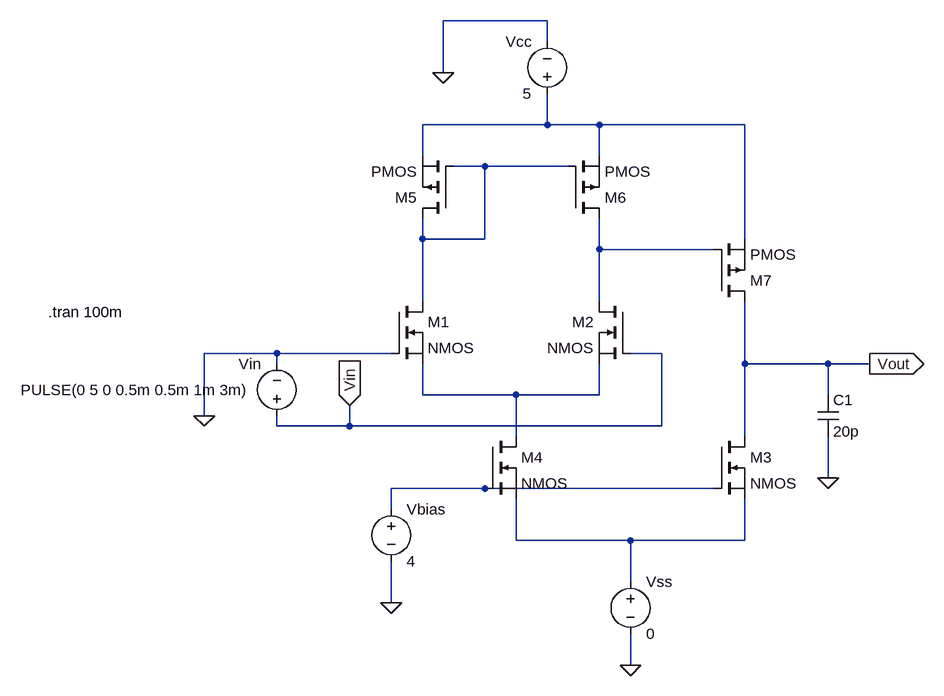
[diagram p0: schematic 2 stage comparator.asc]
2 stage comparator.asc, the LTspice schematic file:
Version 4
SHEET 1 888 680
WIRE 272 -352 112 -352
WIRE 272 -320 272 -352
WIRE 112 -272 112 -352
WIRE 272 -192 272 -240
WIRE 272 -192 80 -192
WIRE 352 -192 272 -192
WIRE 576 -192 352 -192
WIRE 80 -144 80 -192
WIRE 352 -144 352 -192
WIRE 176 -128 128 -128
WIRE 304 -128 176 -128
WIRE 80 -16 80 -48
WIRE 176 -16 176 -128
WIRE 176 -16 80 -16
WIRE 576 -16 576 -192
WIRE 352 0 352 -48
WIRE 528 0 352 0
WIRE 80 80 80 -16
WIRE 352 80 352 0
WIRE -144 160 -256 160
WIRE 32 160 -144 160
WIRE 448 160 400 160
WIRE -144 176 -144 160
WIRE 576 176 576 80
WIRE 704 176 576 176
WIRE 768 176 704 176
WIRE 80 224 80 176
WIRE 224 224 80 224
WIRE 352 224 352 176
WIRE 352 224 224 224
WIRE 704 224 704 176
WIRE -256 256 -256 160
WIRE -144 272 -144 256
WIRE -32 272 -32 240
WIRE -32 272 -144 272
WIRE 448 272 448 160
WIRE 448 272 -32 272
WIRE 224 288 224 224
WIRE 576 288 576 176
WIRE 704 352 704 288
WIRE 176 368 32 368
WIRE 528 368 176 368
WIRE 32 400 32 368
WIRE 224 448 224 384
WIRE 400 448 224 448
WIRE 576 448 576 384
WIRE 576 448 400 448
WIRE 400 512 400 448
WIRE 32 544 32 480
WIRE 400 640 400 592
FLAG 112 -272 0
FLAG 32 544 0
FLAG 400 640 0
FLAG 768 176 Vout
IOPIN 768 176 Out
FLAG 704 352 0
FLAG -256 256 0
FLAG -32 240 Vin
IOPIN -32 240 In
SYMBOL nmos 32 80 R0
SYMATTR InstName M1
SYMBOL nmos 400 80 M0
SYMATTR InstName M2
SYMBOL nmos 176 288 R0
SYMATTR InstName M4
SYMBOL pmos 128 -48 R180
SYMATTR InstName M5
SYMBOL pmos 304 -48 M180
SYMATTR InstName M6
SYMBOL pmos 528 80 M180
SYMATTR InstName M7
SYMBOL voltage 32 384 R0
WINDOW 123 0 0 Left 2
WINDOW 39 0 0 Left 2
SYMATTR InstName Vbias
SYMATTR Value 4
SYMBOL voltage 272 -224 R180
WINDOW 0 24 96 Left 2
WINDOW 3 24 16 Left 2
SYMATTR InstName Vcc
SYMATTR Value 5
SYMBOL voltage -144 272 R180
WINDOW 0 24 96 Left 2
WINDOW 3 43 56 Left 2
WINDOW 123 0 0 Left 2
WINDOW 39 0 0 Left 2
SYMATTR InstName Vin
SYMATTR Value PULSE(0 5 0 0.5m 0.5m 1m 3m)
SYMBOL voltage 400 496 R0
WINDOW 123 0 0 Left 2
WINDOW 39 0 0 Left 2
SYMATTR InstName Vss
SYMATTR Value 0
SYMBOL cap 688 224 R0
SYMATTR InstName C1
SYMATTR Value 20p
SYMBOL nmos 528 288 R0
SYMATTR InstName M3
TEXT -496 96 Left 2 !.tran 100m

The netlist it stands for:
* 2 stage comparator.asc
M1 N002 0 N004 N004 NMOS
M2 N003 Vin N004 N004 NMOS
M4 N004 N005 N006 N006 NMOS
M5 N002 N002 N001 N001 PMOS
M6 N003 N002 N001 N001 PMOS
M7 Vout N003 N001 N001 PMOS
Vbias N005 0 4
Vcc N001 0 5
Vin Vin 0 PULSE(0 5 0 0.5m 0.5m 1m 3m)
Vss N006 0 0
C1 Vout 0 20p
M3 Vout N005 N006 N006 NMOS
.model NMOS NMOS
.model PMOS PMOS
.lib standard.mos
.tran 100m
.backanno
.end